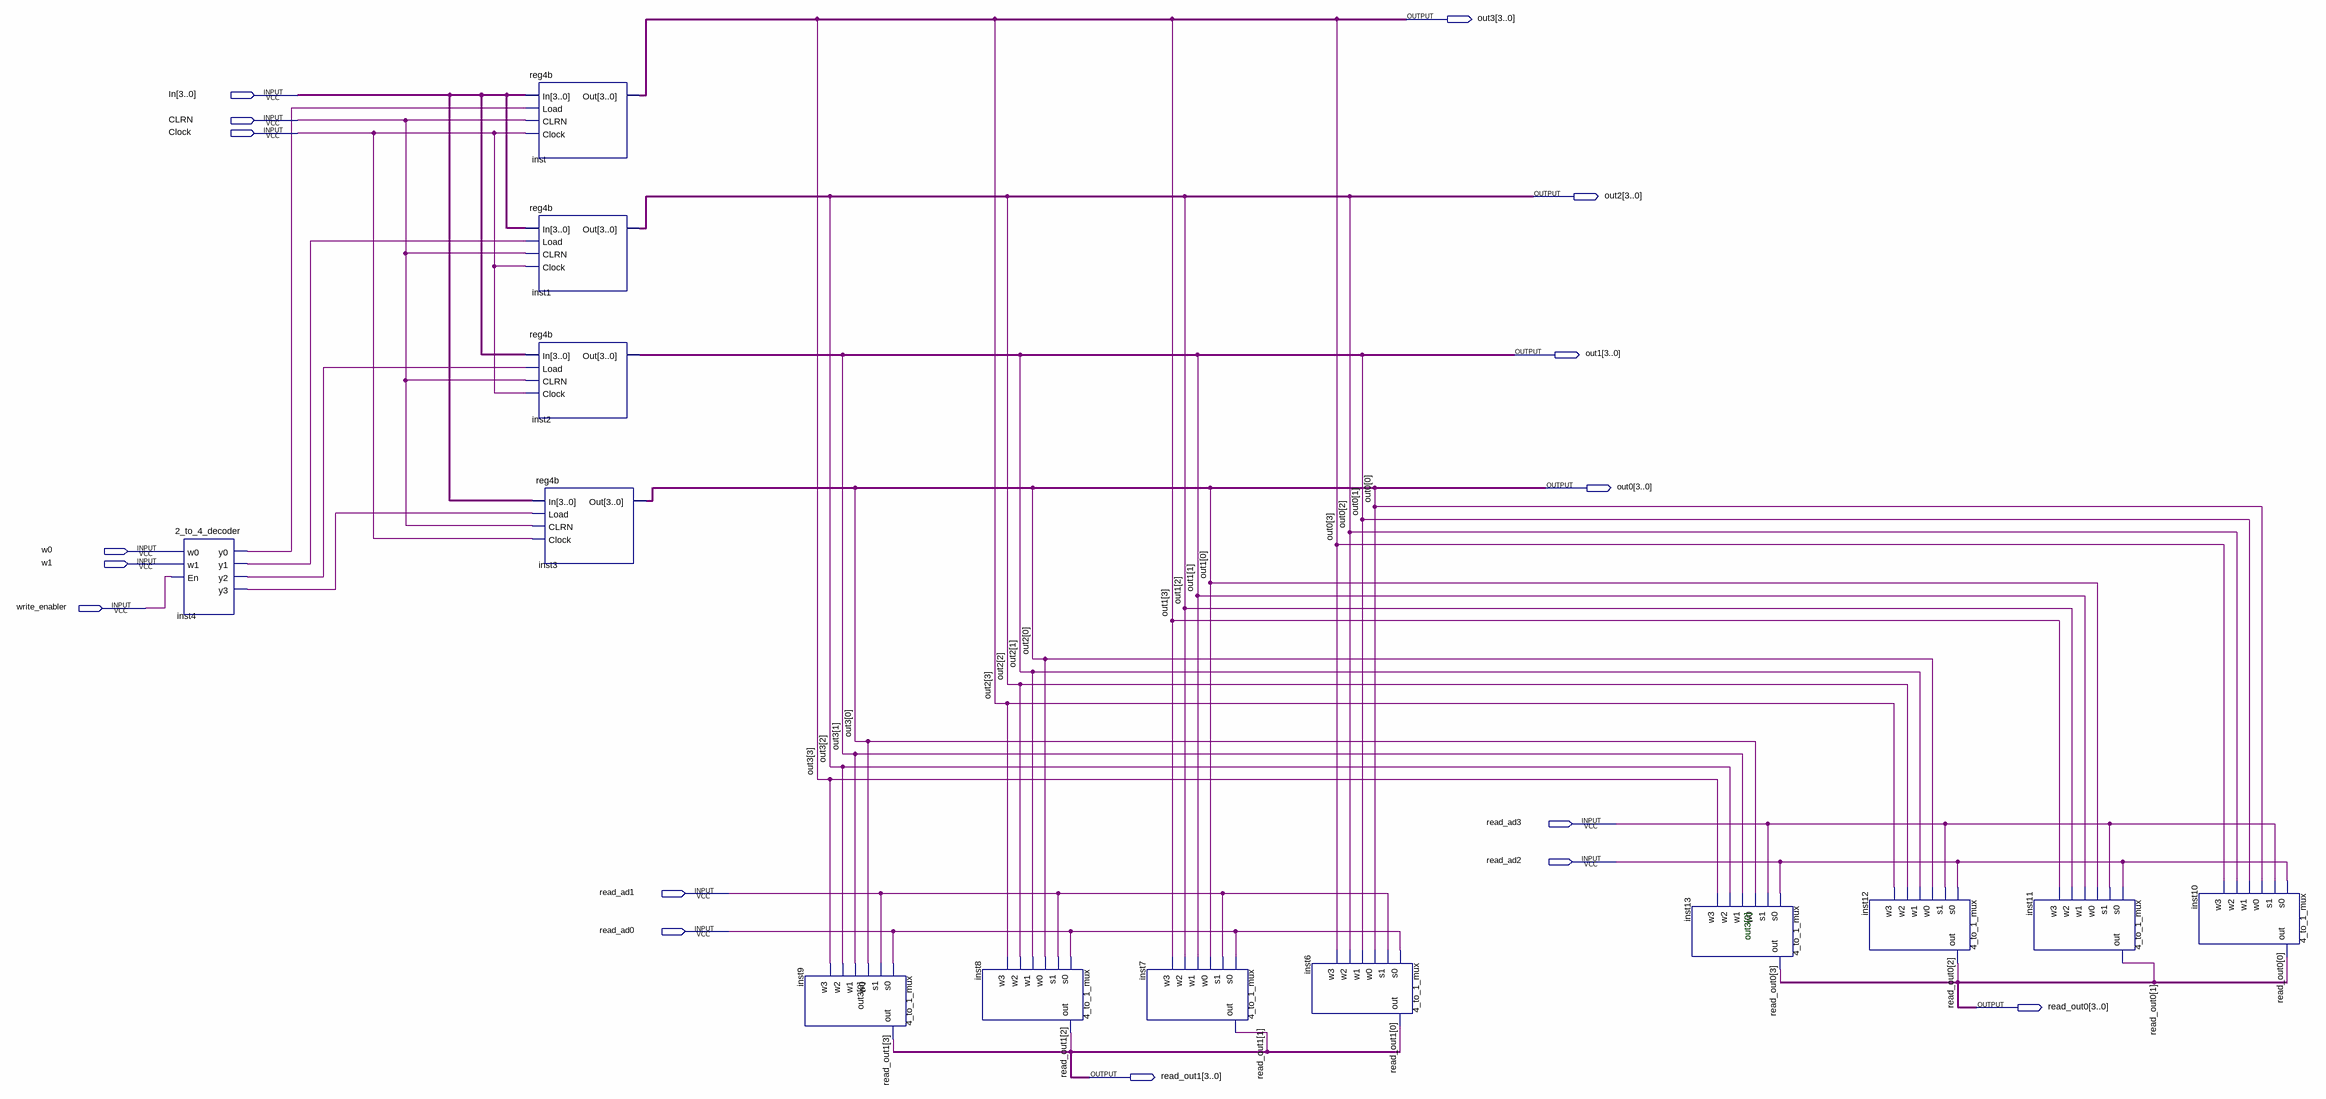
[diagram p0: schematic sheet]
// Quartus schematic register_file_4by1.bdf as structural Verilog: 13 symbols, 16 pins
module register_file_4by1 (
  input  [3:0] In,
  input  CLRN,
  input  Clock,
  input  w0,
  input  w1,
  input  write_enabler,
  input  read_ad3,
  input  read_ad2,
  input  read_ad1,
  input  read_ad0,
  output [3:0] out3,
  output [3:0] out2,
  output [3:0] out1,
  output [3:0] out0,
  output [3:0] read_out0,
  output [3:0] read_out1
);

  wire inst4_y0, inst4_y1, inst4_y2, inst4_y3;

  \2_to_4_decoder  inst4 (
    .w0(w0), .w1(w1), .En(write_enabler), .y0(inst4_y0), .y1(inst4_y1), .y2(inst4_y2), .y3(inst4_y3));
  reg4b inst (.In(In), .Load(inst4_y0), .CLRN(CLRN), .Clock(Clock), .Out(out3));
  reg4b inst1 (.In(In), .Load(inst4_y1), .CLRN(CLRN), .Clock(Clock), .Out(out2));
  reg4b inst2 (.In(In), .Load(inst4_y2), .CLRN(CLRN), .Clock(Clock), .Out(out1));
  reg4b inst3 (.In(In), .Load(inst4_y3), .CLRN(CLRN), .Clock(Clock), .Out(out0));
  \4_to_1_mux  inst9 (
    .s0(read_ad0), .s1(read_ad1), .w0(out3[0]), .w1(out3[1]), .w2(out3[2]), .w3(out3[3]), .out(read_out1[3]));
  \4_to_1_mux  inst8 (
    .s0(read_ad0), .s1(read_ad1), .w0(out2[0]), .w1(out2[1]), .w2(out2[2]), .w3(out2[3]), .out(read_out1[2]));
  \4_to_1_mux  inst7 (
    .s0(read_ad0), .s1(read_ad1), .w0(out1[0]), .w1(out1[1]), .w2(out1[2]), .w3(out1[3]), .out(read_out1[1]));
  \4_to_1_mux  inst6 (
    .s0(read_ad0), .s1(read_ad1), .w0(out0[0]), .w1(out0[1]), .w2(out0[2]), .w3(out0[3]), .out(read_out1[0]));
  \4_to_1_mux  inst13 (
    .s0(read_ad2), .s1(read_ad3), .w0(out3[0]), .w1(out3[1]), .w2(out3[2]), .w3(out3[3]), .out(read_out0[3]));
  \4_to_1_mux  inst12 (
    .s0(read_ad2), .s1(read_ad3), .w0(out2[0]), .w1(out2[1]), .w2(out2[2]), .w3(out2[3]), .out(read_out0[2]));
  \4_to_1_mux  inst11 (
    .s0(read_ad2), .s1(read_ad3), .w0(out1[0]), .w1(out1[1]), .w2(out1[2]), .w3(out1[3]), .out(read_out0[1]));
  \4_to_1_mux  inst10 (
    .s0(read_ad2), .s1(read_ad3), .w0(out0[0]), .w1(out0[1]), .w2(out0[2]), .w3(out0[3]), .out(read_out0[0]));

  // Notes on the sheet:
  //   out3[0]
endmodule
